# EAGLE design maple-r3 (EAGLE 5.01)
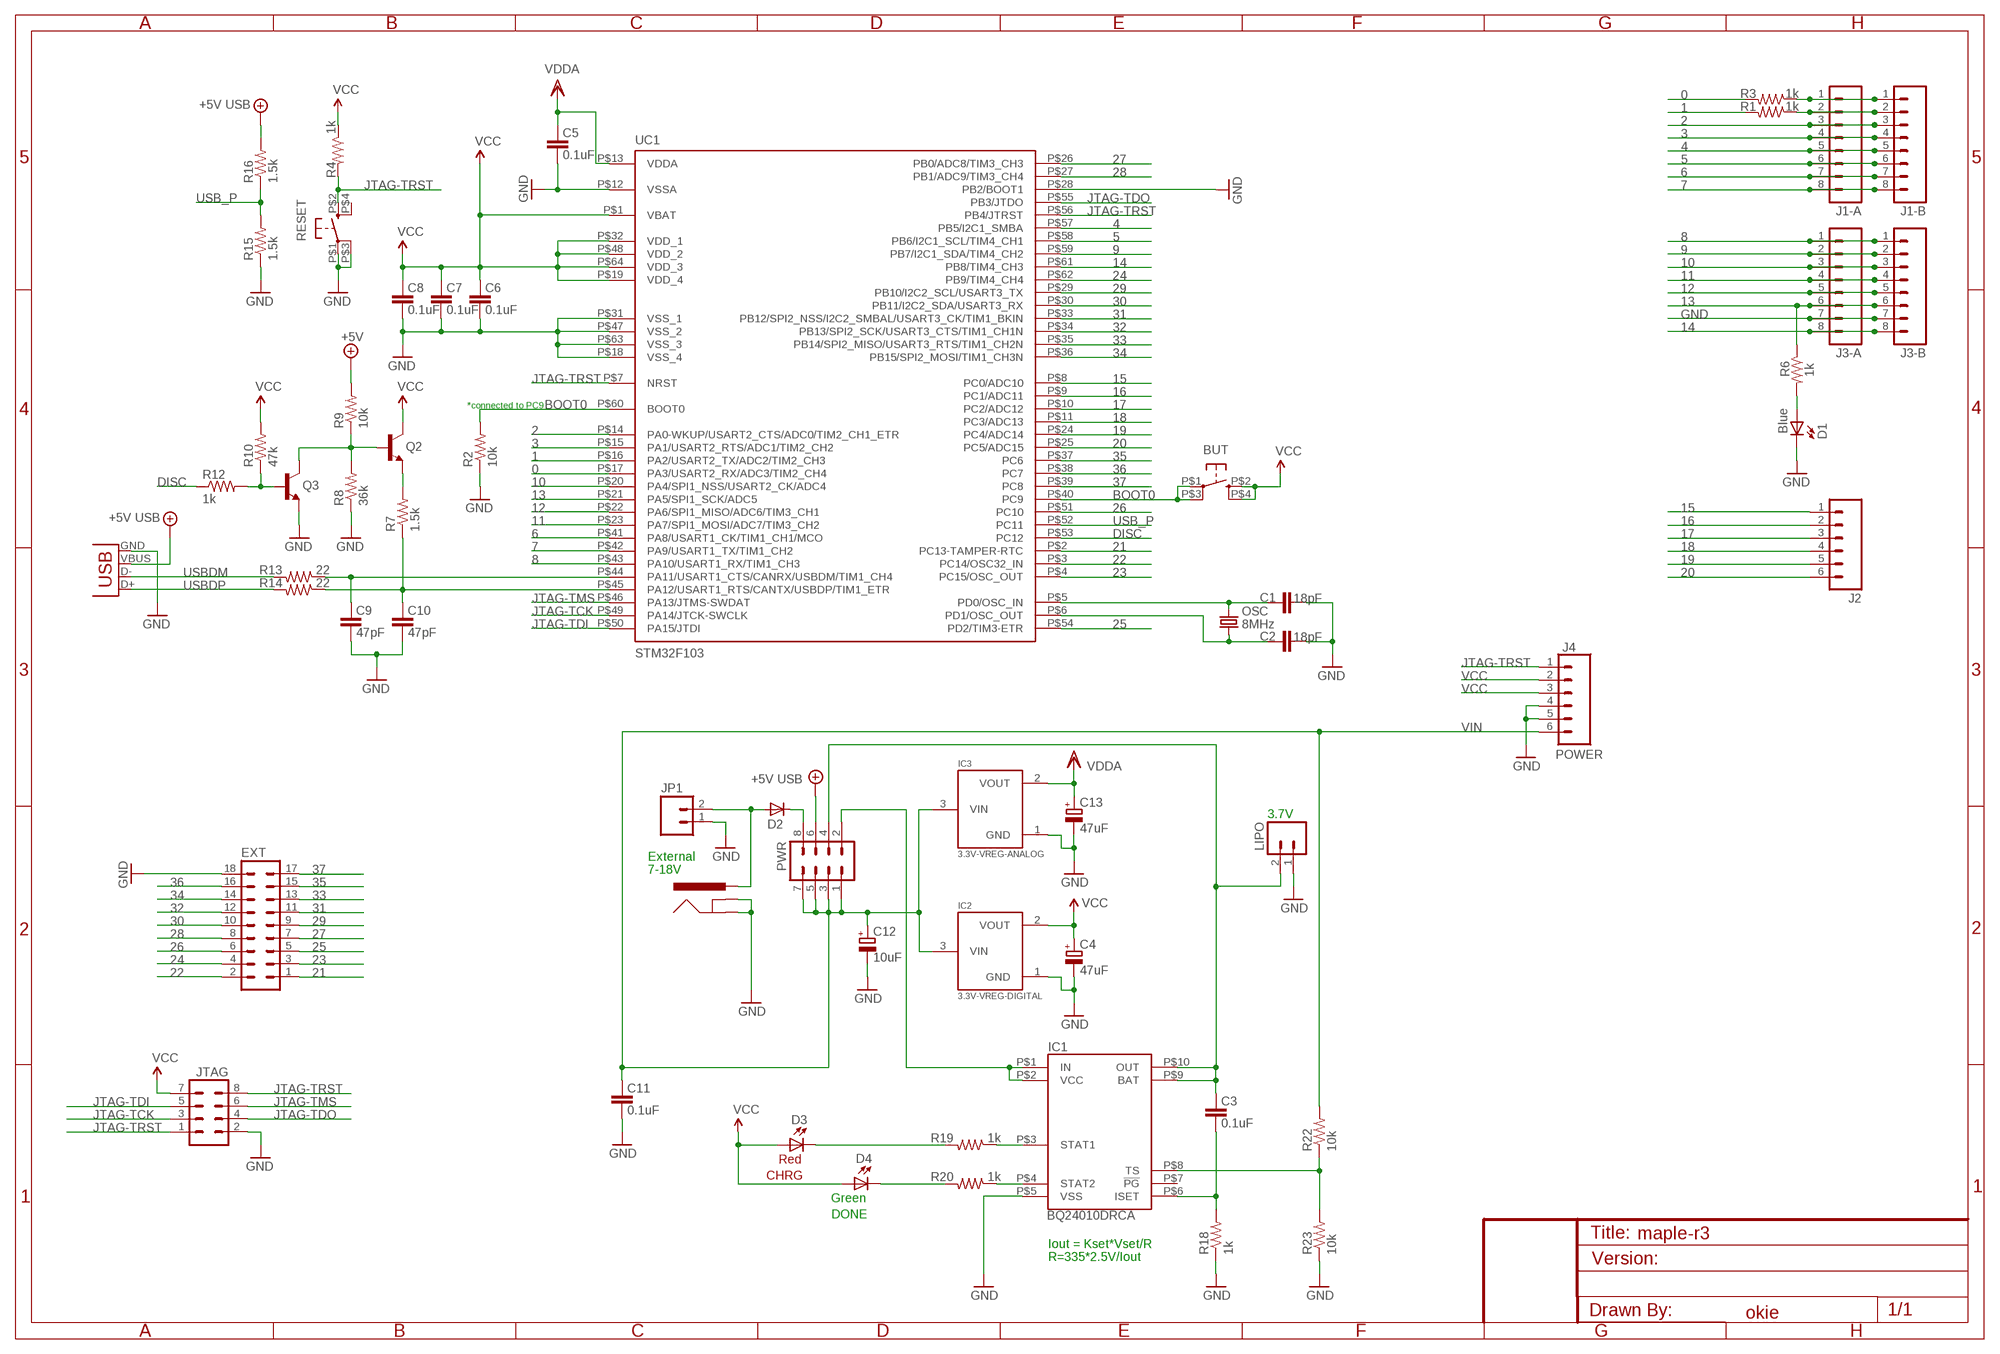
[diagram p0: schematic, sheet 1]

## Parts
BAR  POWER_JACKPTH  [POWER_JACK_PTH]
BUT  BUTTON-KMR241GLFS  [PUSHBUTTON-KMR241GLFS]
C1  18pF  CAP0402  [C0402]
C2  18pF  CAP0402  [C0402]
C3  0.1uF  CAP0402  [C0402]
C4  47uF  CPOL-EUUD-4X5,8  [UD-4X5,8_NICHICON]
C5  0.1uF  CAP0402  [C0402]
C6  0.1uF  CAP0402  [C0402]
C7  0.1uF  CAP0402  [C0402]
C8  0.1uF  CAP0402  [C0402]
C9  47pF  CAP0402  [C0402]
C10  47pF  CAP0402  [C0402]
C11  0.1uF  CAP0402  [C0402]
C12  10uF  CPOL-EUUD-4X5,8  [UD-4X5,8_NICHICON]
C13  47uF  CPOL-EUUD-4X5,8  [UD-4X5,8_NICHICON]
D1  Blue  LED0603  [LED-0603]
D2  DIODE-SOD323-W  [SOD323-W]
D3  Red  LED0603  [LED-0603]
D4  Green  LED0603  [LED-0603]
EXT  MA09-2  [MA09-2]
IC1  BQ24010DRCA  [PSON10-V2]
IC2  3.3V-VREG-DIGITAL  MCP1700T  [SOT23]
IC3  3.3V-VREG-ANALOG  MCP1700T  [SOT23]
J1-A  M08  [1X08]
J1-B  MA08-SQUARE  [1X08-SQUARE]
J2  M06SIP  [1X06]
J3-A  M08  [1X08]
J3-B  MA08-SQUARE  [1X08-SQUARE]
J4  POWER  M06SIP  [1X06]
JP1  M02PTH  [1X02]
JTAG  MA04-2  [MA04-2]
LIPO  LiPo  M02-JST-2MM-SMT  [S2B-PH]
OSC  8MHz  CRYSTAL5X3  [CRYSTAL-SMD-5X3]
PWR  MA04-2  [MA04-2]
Q2  TRANSISTOR_NPNSOT23  [SOT23]
Q3  TRANSISTOR_NPNSOT23  [SOT23]
R1  1k  RESISTOR0402  [C0402]
R2  10k  RESISTOR0402  [C0402]
R3  1k  RESISTOR0402  [C0402]
R4  1k  RESISTOR0402  [C0402]
R6  1k  RESISTOR0402  [C0402]
R7  1.5k  RESISTOR0402  [C0402]
R8  36k  RESISTOR0402  [C0402]
R9  10k  RESISTOR0402  [C0402]
R10  47k  RESISTOR0402  [C0402]
R12  1k  RESISTOR0402  [C0402]
R13  22  RESISTOR0402  [C0402]
R14  22  RESISTOR0402  [C0402]
R15  1.5k  RESISTOR0402  [C0402]
R16  1.5k  RESISTOR0402  [C0402]
R18  1k  RESISTOR0402  [C0402]
R19  1k  RESISTOR0402  [C0402]
R20  1k  RESISTOR0402  [C0402]
R22  10k  RESISTOR0402  [C0402]
R23  10k  RESISTOR0402  [C0402]
RESET  BUTTON-KMR241GLFS  [PUSHBUTTON-KMR241GLFS]
UC1  STM32F103  [TQFP-10X10-64]
X1  USBSMD  [USB-MINIB]

## Nets
0: R3.2 UC1.P$17(PA3/USART2_RX/ADC3/TIM2_CH4)
1: R1.2 UC1.P$16(PA2/USART2_TX/ADC2/TIM2_CH3)
2: J1-A.3 J1-B.3 UC1.P$14(PA0-WKUP/USART2_CTS/ADC0/TIM2_CH1_ETR)
3: J1-A.4 J1-B.4 UC1.P$15(PA1/USART2_RTS/ADC1/TIM2_CH2)
4: J1-A.5 J1-B.5 UC1.P$57(PB5/I2C1_SMBA)
5: J1-A.6 J1-B.6 UC1.P$58(PB6/I2C1_SCL/TIM4_CH1)
6: J1-A.7 J1-B.7 UC1.P$41(PA8/USART1_CK/TIM1_CH1/MCO)
7: J1-A.8 J1-B.8 UC1.P$42(PA9/USART1_TX/TIM1_CH2)
8: J3-A.1 J3-B.1 UC1.P$43(PA10/USART1_RX/TIM1_CH3)
9: J3-A.2 J3-B.2 UC1.P$59(PB7/I2C1_SDA/TIM4_CH2)
10: J3-A.3 J3-B.3 UC1.P$20(PA4/SPI1_NSS/USART2_CK/ADC4)
11: J3-A.4 J3-B.4 UC1.P$23(PA7/SPI1_MOSI/ADC7/TIM3_CH2)
12: J3-A.5 J3-B.5 UC1.P$22(PA6/SPI1_MISO/ADC6/TIM3_CH1)
13: J3-A.6 J3-B.6 R6.1 UC1.P$21(PA5/SPI1_SCK/ADC5)
14: J3-A.8 J3-B.8 UC1.P$61(PB8/TIM4_CH3)
15: J2.1 UC1.P$8(PC0/ADC10)
16: J2.2 UC1.P$9(PC1/ADC11)
17: J2.3 UC1.P$10(PC2/ADC12)
18: J2.4 UC1.P$11(PC3/ADC13)
19: J2.5 UC1.P$24(PC4/ADC14)
20: J2.6 UC1.P$25(PC5/ADC15)
21: EXT.1 UC1.P$2(PC13-TAMPER-RTC)
22: EXT.2 UC1.P$3(PC14/OSC32_IN)
23: EXT.3 UC1.P$4(PC15/OSC_OUT)
24: EXT.4 UC1.P$62(PB9/TIM4_CH4)
25: EXT.5 UC1.P$54(PD2/TIM3-ETR)
26: EXT.6 UC1.P$51(PC10)
27: EXT.7 UC1.P$26(PB0/ADC8/TIM3_CH3)
28: EXT.8 UC1.P$27(PB1/ADC9/TIM3_CH4)
29: EXT.9 UC1.P$29(PB10/I2C2_SCL/USART3_TX)
30: EXT.10 UC1.P$30(PB11/I2C2_SDA/USART3_RX)
31: EXT.11 UC1.P$33(PB12/SPI2_NSS/I2C2_SMBAL/USART3_CK/TIM1_BKIN)
32: EXT.12 UC1.P$34(PB13/SPI2_SCK/USART3_CTS/TIM1_CH1N)
33: EXT.13 UC1.P$35(PB14/SPI2_MISO/USART3_RTS/TIM1_CH2N)
34: EXT.14 UC1.P$36(PB15/SPI2_MOSI/TIM1_CH3N)
35: EXT.15 UC1.P$37(PC6)
36: EXT.16 UC1.P$38(PC7)
37: EXT.17 UC1.P$39(PC8)
+5V: PWR.6 R9.2 R16.2 X1.VBUS ; supply symbol labelled +5V USB
BOOT0: BUT.P$1 BUT.P$3 R2.2 UC1.P$40(PC9) UC1.P$60(BOOT0)
DISC: R12.1 UC1.P$53(PC12)
GND [vcc]: BAR.GND BAR.GNDBREAK C1.1 C2.1 C4.- C5.1 C6.1 C7.1 C8.1 C9.1 C10.1 C11.1 C12.- C13.- D1.C EXT.18 IC1.P$5(VSS) IC2.1(GND) IC3.1(GND) J3-A.7 J3-B.7 J4.4 J4.5 JP1.1 JTAG.2 LIPO.1 Q3.2(E) R2.1 R8.1 R15.1 R18.1 R23.1 RESET.P$1 RESET.P$3 UC1.P$12(VSSA) UC1.P$18(VSS_4) UC1.P$28(PB2/BOOT1) UC1.P$31(VSS_1) UC1.P$47(VSS_2) UC1.P$63(VSS_3) X1.GND
JTAG-TCK: JTAG.3 UC1.P$49(PA14/JTCK-SWCLK)
JTAG-TDI: JTAG.5 UC1.P$50(PA15/JTDI)
JTAG-TDO: JTAG.4 UC1.P$55(PB3/JTDO)
JTAG-TMS: JTAG.6 UC1.P$46(PA13/JTMS-SWDAT)
JTAG-TRST: J4.1 JTAG.1 JTAG.8 R4.2 RESET.P$2 UC1.P$7(NRST) UC1.P$56(PB4/JTRST)
N$1 [vcc]: BAR.PWR D2.A JP1.2
N$2: C2.2 OSC.1 UC1.P$6(PD1/OSC_OUT)
N$3: IC1.P$8(TS) R22.1 R23.2
N$5: D2.C PWR.8
N$6: C1.2 OSC.3 UC1.P$5(PD0/OSC_IN)
N$7: D1.A R6.2
N$8: Q2.2(E) R7.2
N$9: Q2.1(B) Q3.3(C) R8.2 R9.1
N$10: Q3.1(B) R10.1 R12.2
N$11: C9.2 R13.1 UC1.P$44(PA11/USART1_CTS/CANRX/USBDM/TIM1_CH4)
N$12: C10.2 R7.1 R14.1 UC1.P$45(PA12/USART1_RTS/CANTX/USBDP/TIM1_ETR)
N$13: IC1.P$1(IN) IC1.P$2(VCC) PWR.2
N$16 [vcc]: C3.2 IC1.P$9(BAT) IC1.P$10(OUT) LIPO.2 PWR.4
N$19: C3.1 IC1.P$6(ISET) R18.2
N$20: D4.C R20.2
N$21: D3.C R19.2
N$22: IC1.P$3(STAT1) R19.1
N$23: IC1.P$4(STAT2) R20.1
RX-IP: J1-A.2 J1-B.2 R1.1
TX-OP: J1-A.1 J1-B.1 R3.1
USB_P: R15.2 R16.1 UC1.P$52(PC11)
USBDM: R13.2 X1.D-
USBDP: R14.2 X1.D+
VCC: BUT.P$2 BUT.P$4 C4.+ C6.2 C7.2 C8.2 D3.A D4.A IC2.2(VOUT) J4.2 J4.3 JTAG.7 Q2.3(C) R4.1 R10.2 UC1.P$1(VBAT) UC1.P$19(VDD_4) UC1.P$32(VDD_1) UC1.P$48(VDD_2) UC1.P$64(VDD_3)
VDD: C5.2 C13.+ IC3.2(VOUT) UC1.P$13(VDDA) ; supply symbol labelled VDDA
VIN: C11.2 C12.+ IC2.3(VIN) IC3.3(VIN) J4.6 PWR.1 PWR.3 PWR.5 PWR.7 R22.2
Unconnected: IC1.P$7(!PG) RESET.P$4

## Notes on the sheet
- *connected to PC9
- 3.7V
- External
- 7-18V
- CHRG
- DONE
- Iout = Kset*Vset/R
- R=335*2.5V/Iout
- okie

## Library data of the parts
BAR = SparkFun2:POWER_JACK: Power Jack This is the standard 5.5mm barrel jack for power. The PTH is the most common, proven, reliable, footprint. All others are experimental. The Slot footprint only works if the mill layer is transmitted to the PCB fab house so be warned. Spark Fun Electronics SKU : PRT-00119. Mating wall wart : TOL-00298 (and others)
BUT RESET = okie:BUTTON-KMR241GLFS
C1-C3 C5-C11 = SparkFun:CAP: Capacitor Standard 0603 ceramic capacitor, and 0.1" leaded capacitor.
C4 C12 C13 = rcl:CPOL-EU: POLARIZED CAPACITOR, European symbol
D1 D3 D4 = SparkFun:LED: LEDs Standard schematic elements and footprints for 5mm, 3mm, 1206, and 0603 sized LEDs. 5mm - Spark Fun Electronics SKU : COM-00529 (and others)
D2 = diode:DIODE-: DIODE
EXT = con-lstb:MA09-2: PIN HEADER
IC1 = okie:BQ24010DRC
IC2 IC3 = okie:MCP1700T
J1-A J3-A = SparkFun:M08: Header 8 Standard 8-pin 0.1" header. Use with straight break away headers (SKU : PRT-00116), right angle break away headers (PRT-00553), swiss pins (PRT-00743), machine pins (PRT-00117), and female headers (PRT-00115).
J1-B J3-B = SparkFun2:MA08-SQUARE
J2 J4 = SparkFun:M06: Header 6 Standard 6-pin 0.1" header. Use with straight break away headers (SKU : PRT-00116), right angle break away headers (PRT-00553), swiss pins (PRT-00743), machine pins (PRT-00117), and female headers (PRT-00115). Molex polarized connector foot print use with SKU : PRT-08094 with associated crimp pins and housings.
JP1 = SparkFun2:M02: Header 2 Standard 2-pin 0.1" header. Use with straight break away headers (SKU : PRT-00116), right angle break away headers (PRT-00553), swiss pins (PRT-00743), machine pins (PRT-00117), and female headers (PRT-00115). Molex polarized connector foot print use with SKU : PRT-08233 with associated crimp pins and housings.
JTAG PWR = con-lstb:MA04-2: PIN HEADER
LIPO = SparkFun:M02: Header 2 Standard 2-pin 0.1" header. Use with straight break away headers (SKU : PRT-00116), right angle break away headers (PRT-00553), swiss pins (PRT-00743), machine pins (PRT-00117), and female headers (PRT-00115). Molex polarized connector foot print use with SKU : PRT-08233 with associated crimp pins and housings.
OSC = SparkFun2:CRYSTAL: Crystals Various standard crystals. Proven footprints. Spark Fun Electronics SKU : COM-00534
Q2 Q3 = SparkFun2:TRANSISTOR_NPN: Transistor NPN BJT configuration in SOT23 package. MMBT2222 is the common NPN we use. Double check BCE configuration again layout.
R1-R4 R6-R10 R12-R16 R18-R20 R22 R23 = SparkFun:RESISTOR: Resistor Basic schematic elements and footprints for 0603, 1206, and PTH 1/10th watt (small) resistors.
UC1 = st-microelectronics:STM32F103
X1 = SparkFun2:USB: USB Connectors USB-B-PTH is fully proven SKU : PRT-00139 USB-miniB is fully proven SKU : PRT-00587 USB-A-PCB is untested. USB-A-H is throughly reviewed, but untested. Spark Fun Electronics SKU : PRT-00437 USB-B-SMT is throughly reviewed, but untested. Needs silkscreen touching up. USB-A-S has not been used/tested USB-MB-H has not been used/tested

## Net classes
0 default: width 0.203 mm
1 vcc: width 0.254 mm
2 gnd: width 0.305 mm, drill 0.508 mm, clearance 0.152 mm
3 usbvcc: width 0.508 mm, drill 0.508 mm, clearance 0.152 mm

## Board
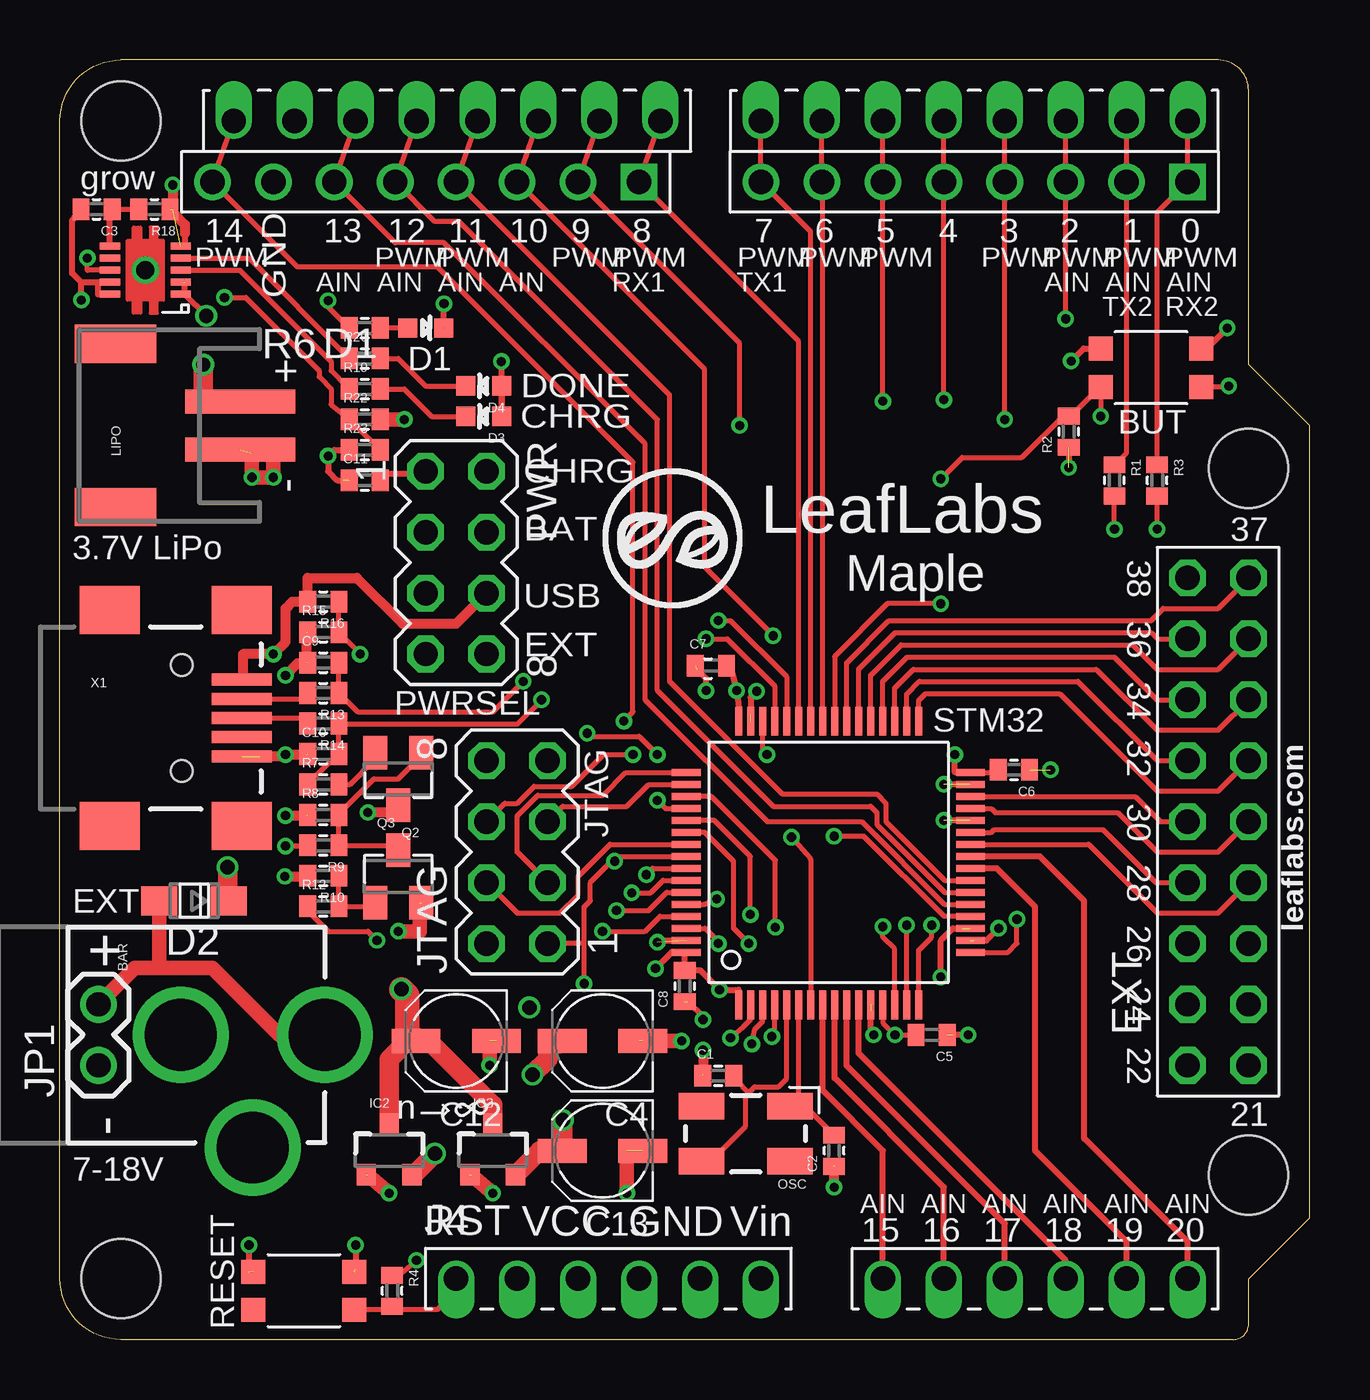
[diagram p1: board, top side]
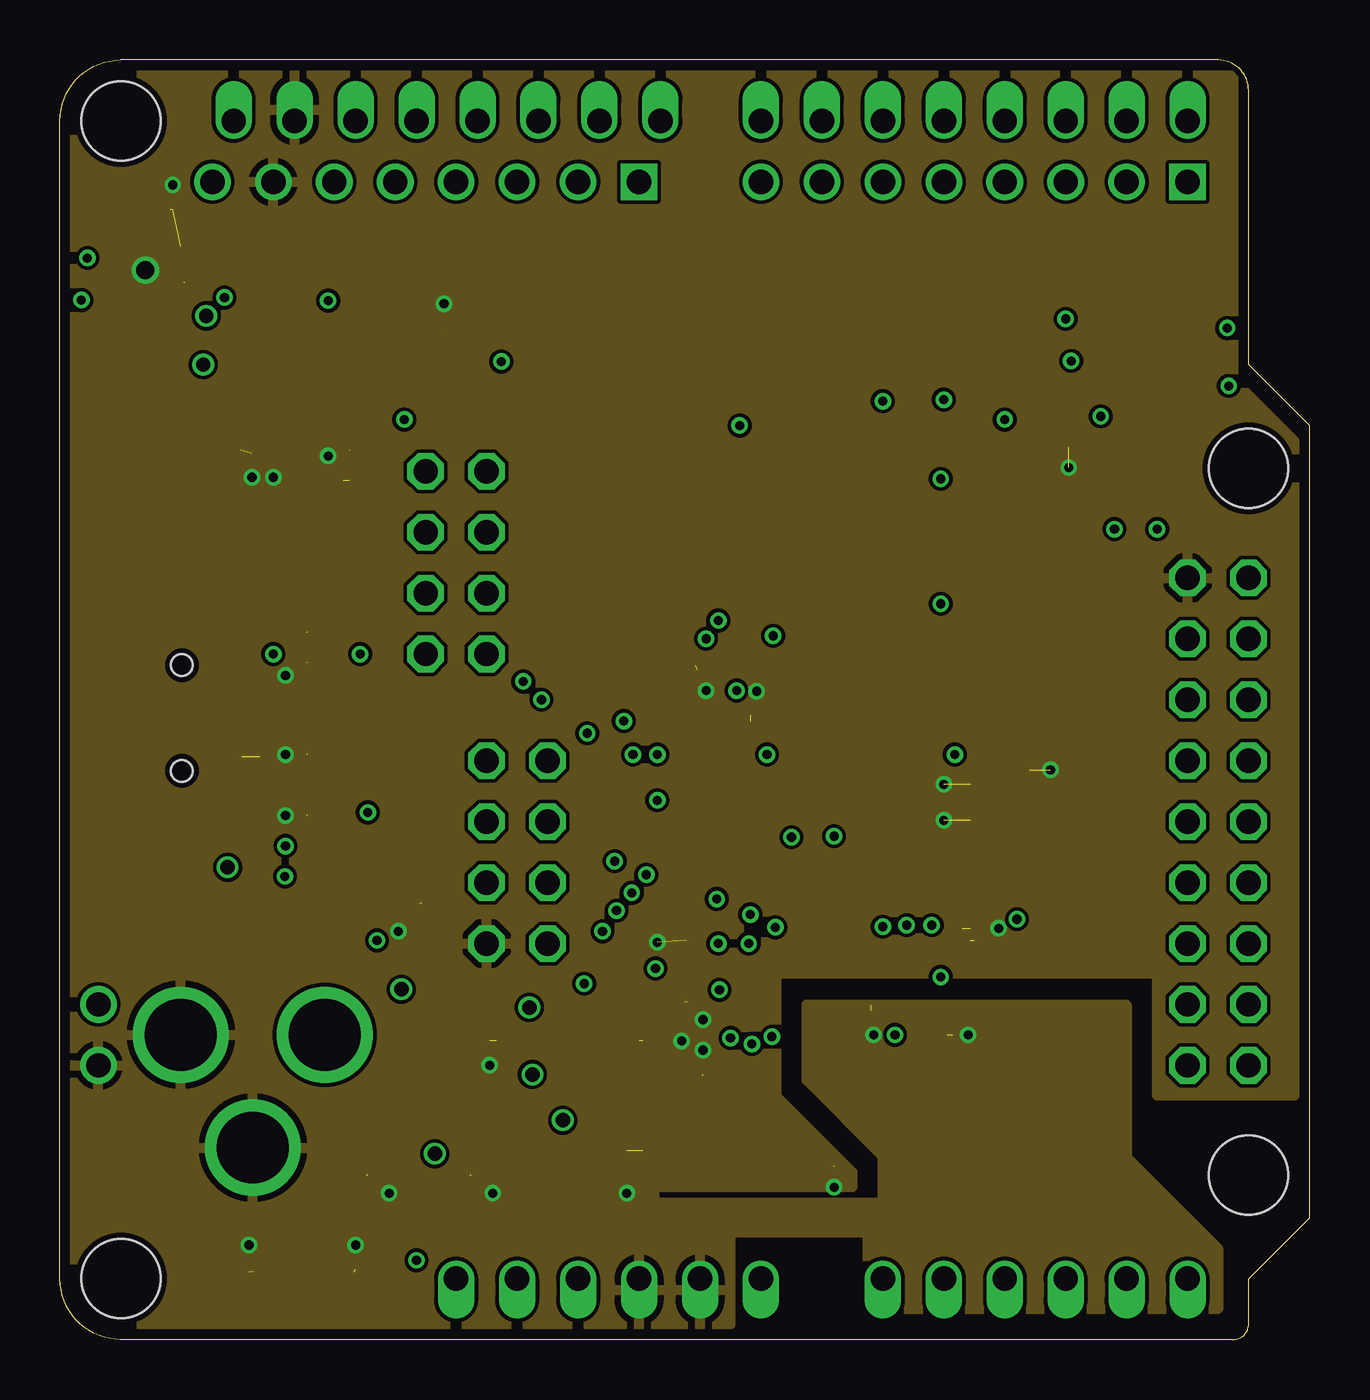
[diagram p2: board, inner layer gndplane]
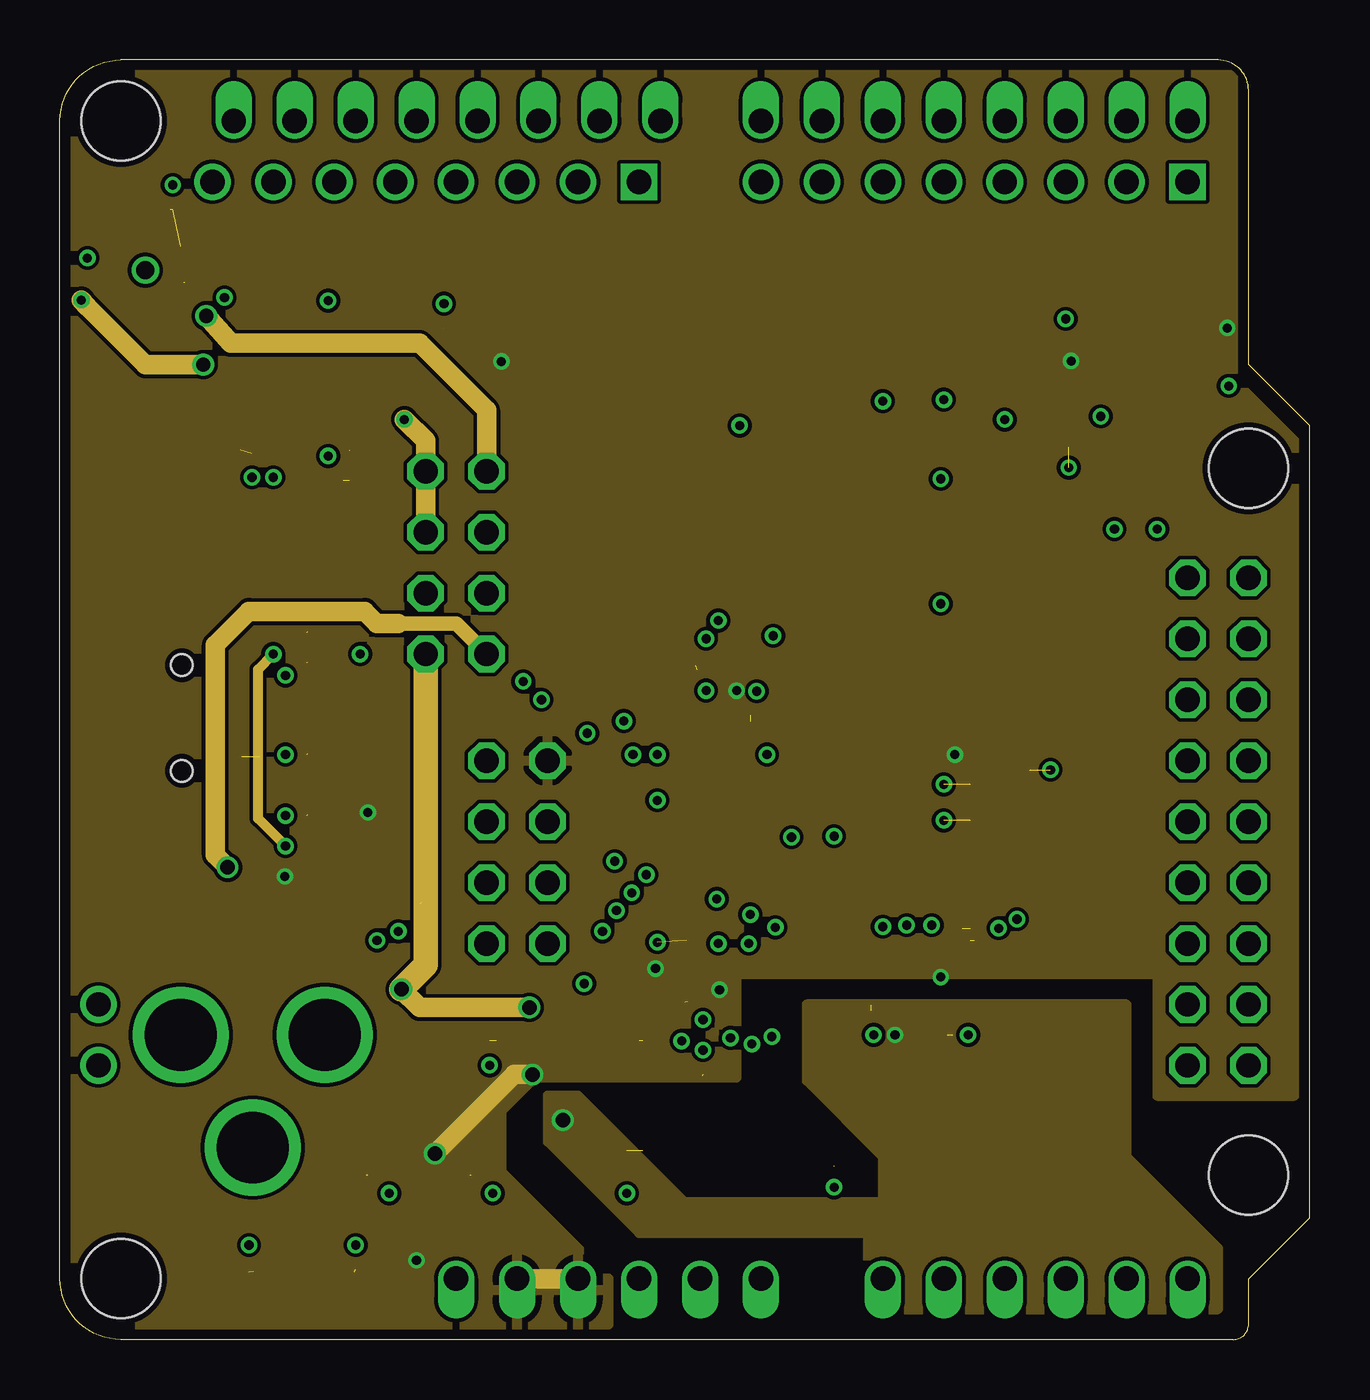
[diagram p3: board, inner layer Route15]
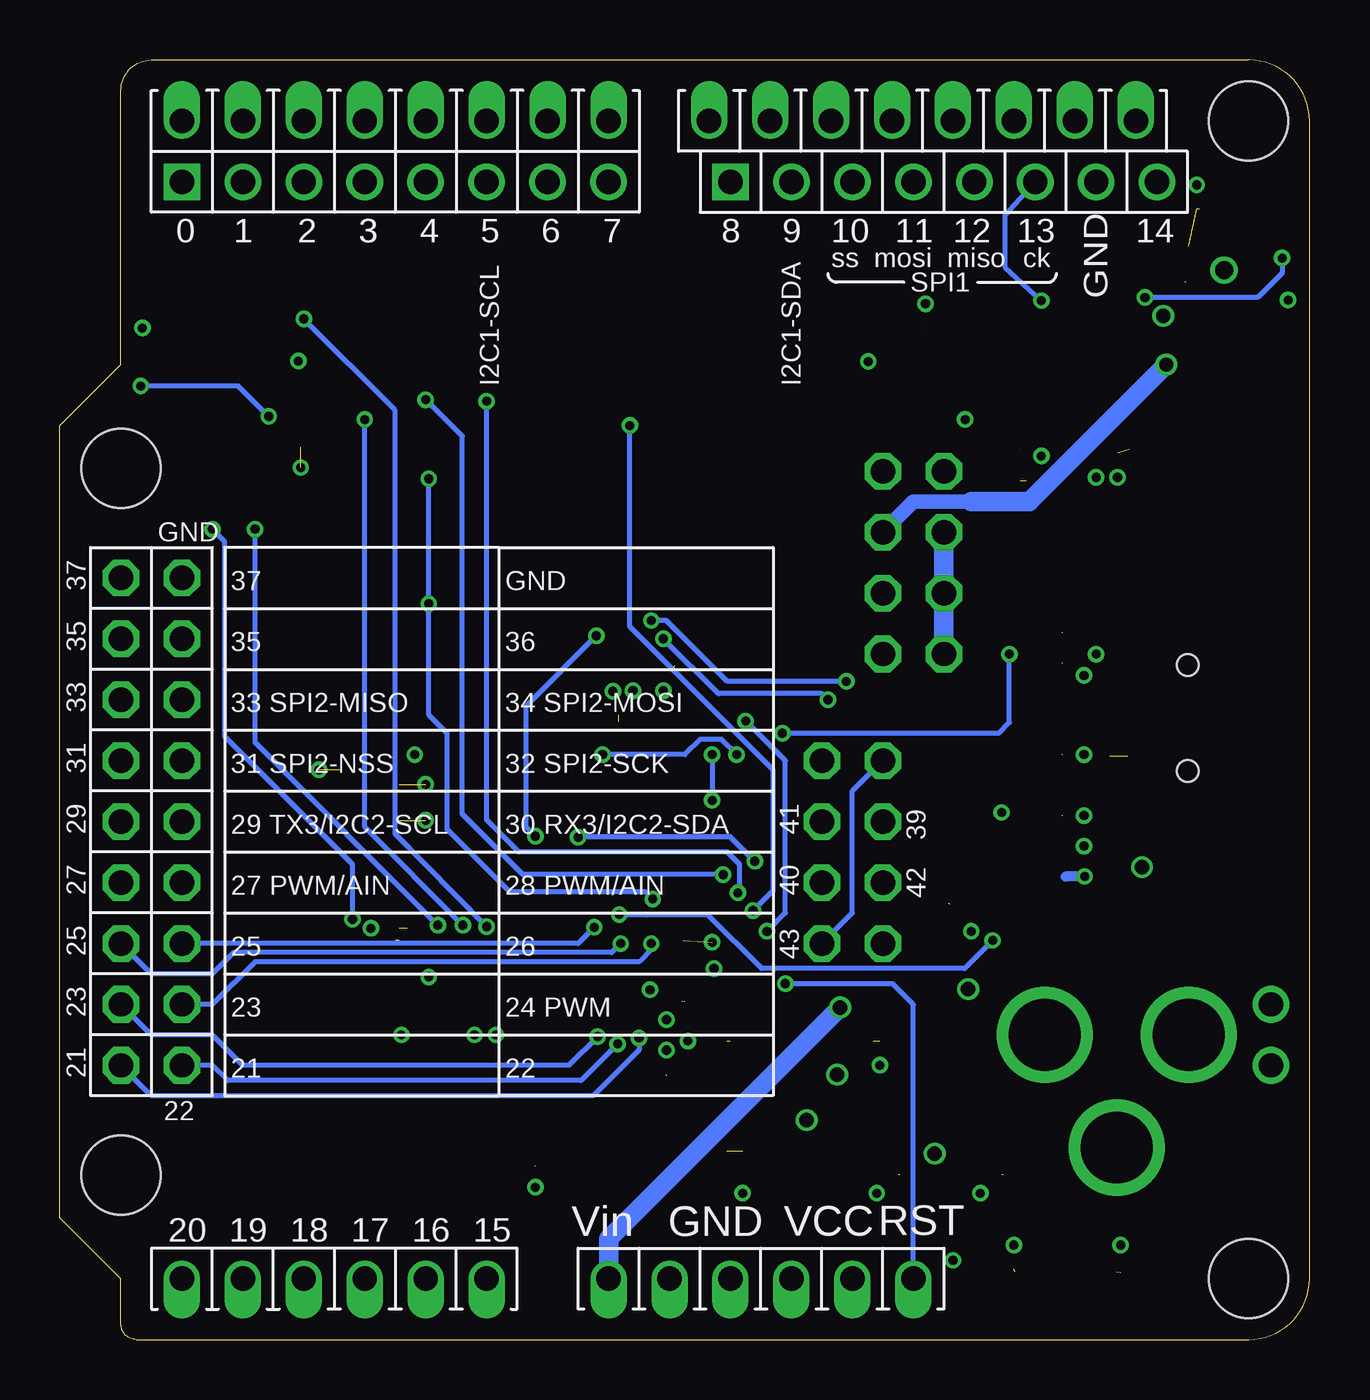
[diagram p4: board, bottom side, seen from below]

Size 52.07 x 53.34 mm. Coordinates in mm from the lower left corner, seen from the top.
Outline: 49.53,2.54 52.07,5.08 52.07,38.1 49.53,40.64 49.53,52.07 arc90 48.26,53.34 2.54,53.34 arc90 0,50.8 0,2.54 arc90 2.54,0 48.9,0 arc90 49.53,0.64 49.53,2.54
Copper layers (1*16): Top 0.035mm / dielectric 1.5mm / Bottom 0.035mm
Design rules "SparkFun *": minimum track width 6mil, minimum drill 15mil, track to track 6mil, track to pad 6mil, pad to pad 6mil, via to via 6mil, smd to smd 6mil, copper to edge 10mil, drill to drill 15mil, minimum pad ring 8mil, minimum via ring 6mil, stop-mask expansion 0mil, vias tented up to drill 20mil, thermal gap 10mil

### Footprints (pad centres in the part's own frame; a part is rotated, then mirrored left to right if it is on the bottom)
POWER_JACK_PTH = drill 2.997 round: GND 0,7.7; GNDBREAK 4.7,10.7; PWR 0,13.7
PUSHBUTTON-KMR241GLFS = smd 1 x 1: P$1 2.1,0.8; P$2 2.1,-0.8; P$3 -2.1,0.8; P$4 -2.1,-0.8
C0402 = smd 0.7 x 0.9: 1 -0.65,0; 2 0.65,0
UD-4X5,8_NICHICON = smd 2.032 x 1: + 1.679,0; - -1.679,0
LED-0603 = smd 0.8 x 0.8: A 0,-0.75; C 0,0.75
SOD323-W = smd 1.5 x 1.2: A 1.45,0; C -1.45,0
MA09-2 = drill 1.016 octagon: 1 -10.16,-1.27; 2 -10.16,1.27; 3 -7.62,-1.27; 4 -7.62,1.27; 5 -5.08,-1.27; 6 -5.08,1.27; 7 -2.54,-1.27; 8 -2.54,1.27; 9 0,-1.27; 10 0,1.27; 11 2.54,-1.27; 12 2.54,1.27; 13 5.08,-1.27; 14 5.08,1.27; 15 7.62,-1.27; 16 7.62,1.27; 17 10.16,-1.27; 18 10.16,1.27
PSON10-V2 = smd 0.85 x 0.28: P$1 -1.475,1; P$2 -1.475,0.5; P$3 -1.475,0; P$4 -1.475,-0.5; P$5 -1.475,-1; P$6 1.475,-1; P$7 1.475,-0.5; P$8 1.475,0; P$9 1.475,0.5; P$10 1.475,1
SOT23 = smd 0.8 x 0.9: 1 -0.95,-1; 2 0.95,-1; 3 0,1.1
1X08 = drill 1.016 offset: 1 0,0; 2 2.54,0; 3 5.08,0; 4 7.62,0; 5 10.16,0; 6 12.7,0; 7 15.24,0; 8 17.78,0
1X08-SQUARE = drill 1.016 square: 1 -8.89,0 | drill 1.016 round: 2 -6.35,0; 3 -3.81,0; 4 -1.27,0; 5 1.27,0; 6 3.81,0; 7 6.35,0; 8 8.89,0
1X06 = drill 1.016 offset: 1 0,0; 2 2.54,0; 3 5.08,0; 4 7.62,0; 5 10.16,0; 6 12.7,0
1X02 = drill 1.016 round: 1 0,0; 2 2.54,0
MA04-2 = drill 1.016 octagon: 1 -3.81,-1.27; 2 -3.81,1.27; 3 -1.27,-1.27; 4 -1.27,1.27; 5 1.27,-1.27; 6 1.27,1.27; 7 3.81,-1.27; 8 3.81,1.27
S2B-PH = smd 1 x 4.6: 1 -1,-3.7; 2 1,-3.7 | smd 1.6 x 3.4: NC1 -3.4,1.5; NC2 3.4,1.5
CRYSTAL-SMD-5X3 = smd 1.9 x 1.1: 1 -1.85,-1.15; 2 1.85,-1.15; 3 1.85,1.15; 4 -1.85,1.15
SOT23' = smd 1 x 1.4: 1 -0.95,-1.1; 2 0.95,-1.1; 3 0,1.1
STAND-OFF = hole 3.302: 0,0
TQFP-10X10-64 = smd 1.2 x 0.3: P$1 -5.936,3.75; P$2 -5.936,3.25; P$3 -5.936,2.75; P$4 -5.936,2.25; P$5 -5.936,1.75; P$6 -5.936,1.25; P$7 -5.936,0.75; P$8 -5.936,0.25; P$9 -5.936,-0.25; P$10 -5.936,-0.75; P$11 -5.936,-1.25; P$12 -5.936,-1.75; P$13 -5.936,-2.25; P$14 -5.936,-2.75; P$15 -5.936,-3.25; P$16 -5.936,-3.75; P$33 5.886,-3.75; P$34 5.886,-3.25; P$35 5.886,-2.75; P$36 5.886,-2.25; P$37 5.886,-1.75; P$38 5.886,-1.25; P$39 5.886,-0.75; P$40 5.886,-0.25; P$41 5.886,0.25; P$42 5.886,0.75; P$43 5.886,1.25; P$44 5.886,1.75; P$45 5.886,2.25; P$46 5.886,2.75; P$47 5.886,3.25; P$48 5.886,3.75 | smd 0.3 x 1.2: P$17 -3.75,-5.911; P$18 -3.25,-5.911; P$19 -2.75,-5.911; P$20 -2.25,-5.911; P$21 -1.75,-5.911; P$22 -1.25,-5.911; P$23 -0.75,-5.911; P$24 -0.25,-5.911; P$25 0.25,-5.911; P$26 0.75,-5.911; P$27 1.25,-5.911; P$28 1.75,-5.911; P$29 2.25,-5.911; P$30 2.75,-5.911; P$31 3.25,-5.911; P$32 3.75,-5.911; P$49 3.75,5.936; P$50 3.25,5.936; P$51 2.75,5.936; P$52 2.25,5.936; P$53 1.75,5.936; P$54 1.25,5.936; P$55 0.75,5.936; P$56 0.25,5.936; P$57 -0.25,5.936; P$58 -0.75,5.936; P$59 -1.25,5.936; P$60 -1.75,5.936; P$61 -2.25,5.936; P$62 -2.75,5.936; P$63 -3.25,5.936; P$64 -3.75,5.936
USB-MINIB = smd 2.5 x 0.5: D+ 2.5,0; D- 2.5,0.8; GND 2.5,-1.6; ID 2.5,-0.8; VBUS 2.5,1.6 | smd 2.5 x 2: GND@1 -3,-4.5; GND@2 -3,4.5; GND@3 2.5,4.5; GND@4 2.5,-4.5 | hole 0.9: 0,2.2; 0,-2.2

### Placement (x,y rotation side)
BAR  -2.67,12.7 270 top
BUT  45.47,40.51 180 top
C1  27.43,11 0 top
C2  32.26,7.87 90 top
C3  1.52,47.12 180 top
C4  22.61,12.45 180 top
C5  36.32,12.7 180 top
C6  39.75,23.75 180 top
C7  27.13,28.09 0 top
C8  26.04,14.73 90 top
C9  10.97,28.22 0 top
C10  10.97,24.41 0 top
C11  12.7,35.81 0 top
C12  16.51,12.45 180 top
C13  22.61,7.87 180 top
D1  15.24,42.16 270 top
D2  5.59,18.29 180 top
D3  17.65,38.48 90 top
D4  17.65,39.75 90 top
EXT  48.26,21.59 90 top
IC1  3.56,44.58 180 top
IC2  13.72,7.87 0 top
IC3  18.03,7.87 0 top
J1-A  46.99,50.8 180 top
J1-B  38.1,48.26 180 top
J2  34.29,2.54 0 top
J3-A  25.02,50.8 180 top
J3-B  15.24,48.26 180 top
J4  16.51,2.54 0 top
JP1  1.6,11.43 90 top
JTAG  19.05,20.32 90 top
LIPO  3.81,38.1 90 top
OSC  28.57,8.59 180 top
PWR  16.51,32.38 270 top
Q2  [SOT23']  14.1,23.37 180 top
Q3  [SOT23']  14.1,19.3 0 top
R1  43.94,35.81 270 top
R2  42.04,37.85 90 top
R3  45.72,35.81 270 top
R4  13.84,2.03 270 top
R6  12.7,42.16 0 top
R7  10.97,23.14 0 top
R8  10.97,21.87 0 top
R9  10.97,20.6 180 top
R10  10.97,19.33 180 top
R12  10.97,18.06 0 top
R13  10.97,26.95 180 top
R14  10.97,25.68 180 top
R15  10.97,29.49 0 top
R16  10.97,30.76 180 top
R18  3.94,47.12 180 top
R19  12.7,39.62 0 top
R20  12.7,40.89 0 top
R22  12.7,38.35 0 top
R23  12.7,37.08 0 top
RESET  10.16,2.03 0 top
U$1  STAND-OFF  [STAND-OFF]  2.54,2.54 0 top
U$2  STAND-OFF  [STAND-OFF]  49.53,36.32 0 top
U$4  STAND-OFF  [STAND-OFF]  2.54,50.8 0 top
U$10  STAND-OFF  [STAND-OFF]  49.53,6.86 0 top
UC1  32.03,19.89 90 top
X1  5.08,25.91 0 top

### Tracks (layer width: path | path; a pad name or v marks a point on that pad's centre or on a via)
0  (via drill 0.38)
  Top 0.203: v39.88,17.53 39.88,16.51 39.51,16.14 UC1.P$17 | v45.72,33.78 R3.2
  Bottom 0.203: v39.88,17.53 39.88,19.81 45.21,25.15 45.21,33.27 v45.72,33.78
1  (via drill 0.38)
  Top 0.203: UC1.P$16 35.78,16.22 36.32,16.76 v36.32,17.27 | v43.94,33.78 R1.2
  Bottom 0.203: v36.32,17.27 43.94,24.89 v43.94,33.78
2  (via drill 0.38)
  Top 0.203: J1-B.3 J1-A.3 J1-B.3 | UC1.P$14 34.78,16.27 34.29,16.76 v34.29,17.21 | v41.91,42.55 J1-B.3
  Bottom 0.203: v34.29,17.21 38.1,21.08 38.1,38.73 v41.91,42.55
3  (via drill 0.38)
  Top 0.203: J1-B.4 J1-A.4 J1-B.4 | UC1.P$15 v35.28,17.27 | v39.37,38.35 J1-B.4
  Bottom 0.203: v35.28,17.27 39.37,21.36 v39.37,38.35
4  (via drill 0.38)
  Top 0.203: J1-B.5 J1-A.5 J1-B.5 | UC1.P$57 24.69,19.64 v24.43,19.38 | v36.83,39.18 J1-B.5
  Bottom 0.203: v36.83,39.18 35.31,37.66 35.31,21.91 32.78,19.38 v24.43,19.38
5  (via drill 0.38)
  Top 0.203: J1-B.6 J1-A.6 J1-B.6 | UC1.P$58 25.13,19.14 24.61,18.62 v23.82,18.62 | v34.29,39.12 J1-B.6
  Bottom 0.203: v23.82,18.62 23.82,18.64 23.75,18.72 23.75,19.81 24.26,20.32 32.96,20.32 34.29,21.65 v34.29,39.12
6
  Top 0.203: J1-B.7 J1-A.7 | UC1.P$41 31.78,48.23
  Top 0.254: 31.77,48.23 31.77,48.21 | 31.78,48.23 31.77,48.23 | J1-B.7 31.77,48.23
7
  Top 0.203: J1-A.8 J1-B.8 31.28,46.19 UC1.P$42
8
  Top 0.203: UC1.P$43 30.78,41.61 J3-B.1 J3-A.1
9  (via drill 0.38)
  Top 0.203: UC1.P$59 25.29,18.64 24.54,17.88 v23.19,17.88 | v28.32,38.1 28.32,41.53 J3-B.2 J3-A.2
  Bottom 0.203: v23.19,17.88 22.35,18.72 22.35,23.75 28.32,29.72 v28.32,38.1
10  (via drill 0.38)
  Top 0.203: UC1.P$20 36.84,17.64 33.5,20.98 v32.26,20.98 | v29.72,29.34 26.86,32.19 26.86,40.45 J3-B.3 J3-A.3
  Bottom 0.203: v29.72,29.34 32.64,26.42 32.64,21.36 v32.26,20.98
11
  Top 0.203: UC1.P$23 36.87,19.14 34.42,21.59 34.42,22.35 34.04,22.73 30.1,22.73 25.4,27.43 25.4,39.37 J3-B.4 J3-A.4
12
  Top 0.203: UC1.P$22 36.86,18.64 34.04,21.46 34.04,21.97 33.78,22.23 29.72,22.23 24.89,27.05 24.89,38.35 16.64,46.61 15.62,46.61 J3-B.5 J3-A.5
13  (via drill 0.38)
  Top 0.203: UC1.P$21 36.85,18.14 33.4,21.59 29.46,21.59 24.38,26.67 24.38,37.34 16,45.72 13.97,45.72 J3-B.6 J3-A.6 | R6.1 11.18,43.04 v11.18,43.31
  Bottom 0.203: J3-B.6 12.7,46.86 12.7,44.7 v11.18,43.31
14  (via drill 0.38)
  Top 0.203: UC1.P$61 25,17.64 24.38,17.02 v22.61,17.02 | v23.5,25.78 23.88,26.16 23.88,36.58 15.75,44.7 9.91,44.7 J3-B.8 J3-A.8
  Bottom 0.203: v22.61,17.02 21.84,17.78 21.84,24.13 v23.5,25.78
15
  Top 0.254: UC1.P$8 31.78,10.38 34.29,7.87 J2.1
16
  Top 0.254: UC1.P$9 32.28,10.9 36.83,6.35 J2.2
17
  Top 0.254: UC1.P$10 32.78,11.42 39.37,4.83 J2.3
18
  Top 0.254: UC1.P$11 33.28,11.93 41.91,3.3 J2.4
19
  Top 0.254: UC1.P$24 39.04,19.64 40.64,18.03 40.64,7.87 44.45,4.06 J2.5
20
  Top 0.254: UC1.P$25 40.82,20.14 42.67,18.29 42.67,8.38 46.99,4.06 J2.6
21  (via drill 0.38)
  Top 0.203: UC1.P$2 28.78,13.34 28.47,13.03 v27.94,12.57
  Bottom 0.203: EXT.1 48.26,10.16 29.84,10.16 27.94,12.06 v27.94,12.57
22  (via drill 0.38)
  Top 0.203: UC1.P$3 29.28,13.25 28.96,12.93 28.83,12.27 v28.83,12.32
  Bottom 0.203: EXT.2 45.72,11.43 45.09,10.79 30.35,10.79 v28.83,12.32
23  (via drill 0.38)
  Top 0.203: v29.67,12.62 29.72,12.57 29.78,12.63 UC1.P$4
  Bottom 0.203: EXT.3 48.26,12.7 45.72,12.7 44.45,11.43 30.86,11.43 v29.67,12.62 29.59,12.7 29.87,12.7
24  (via drill 0.38)
  Top 0.203: UC1.P$62 26.88,17.14 27.43,16.59 v27.43,16.51
  Bottom 0.203: v27.43,16.51 27.43,16.26 27.94,15.75 43.94,15.75 45.72,13.97 EXT.4
25  (via drill 0.38)
  Top 0.203: UC1.P$54 26.87,21.14 28.07,19.94 28.07,17.14 v28.7,16.51
  Bottom 0.203: v28.7,16.51 29.08,16.13 44.83,16.13 45.72,15.24 48.26,15.24 EXT.5
26  (via drill 0.38)
  Top 0.203: UC1.P$51 27.15,22.64 29.81,19.98 v29.81,17.18
  Bottom 0.203: v29.81,17.18 30.48,16.51 EXT.6
27
  Top 0.203: UC1.P$26 42.86,20.64 45.72,17.78 48.26,17.78 EXT.7
28
  Top 0.203: UC1.P$27 38.82,21.14 38.94,21.26 43.46,21.26 45.67,19.05 EXT.8
29
  Top 0.203: UC1.P$29 38.8,22.14 38.96,21.97 44.07,21.97 45.72,20.32 48.26,20.32 EXT.9
30
  Top 0.203: UC1.P$30 44.8,22.64 45.85,21.59 EXT.10
31
  Top 0.203: UC1.P$33 35.78,26.64 36.07,26.92 41.66,26.92 45.72,22.86 48.26,22.86 EXT.11
32
  Top 0.203: UC1.P$34 35.28,26.9 35.81,27.43 42.42,27.43 45.72,24.13 EXT.12
33
  Top 0.203: UC1.P$35 34.78,27.16 35.56,27.94 43.18,27.94 45.72,25.4 48.26,25.4 EXT.13
34
  Top 0.203: UC1.P$36 34.28,27.42 35.31,28.45 43.94,28.45 45.72,26.67 EXT.14
35
  Top 0.203: UC1.P$37 33.78,27.68 35.05,28.96 44.7,28.96 45.72,27.94 48.26,27.94 EXT.15
36
  Top 0.203: UC1.P$38 33.28,27.95 34.8,29.46 45.47,29.46 45.72,29.21 EXT.16
37
  Top 0.203: UC1.P$39 32.78,28.21 34.54,29.97 45.47,29.97 45.97,30.48 48.26,30.48 EXT.17
+5V  (via drill 0.38)
  Top 0.203: 9.88,20.57 9.78,20.57 | 9.88,20.57 10.3,20.57 | v9.4,20.57 9.88,20.57
  Top 0.406: 7.62,27.51 X1.VBUS | 7.62,27.51 8.59,27.51 | 10.3,20.57 R9.2 | 7.62,27.51 7.62,28.57 v8.89,28.57 9.4,29.08 9.4,30.48 9.68,30.76 R16.2 10.32,31.75 12.37,31.75 14.28,29.84 16.51,29.84 PWR.6
  Route15 0.406: v9.4,20.57 8.26,21.72 8.26,27.94 v8.89,28.57
BOOT0  (via drill 0.38 pad 0.38)
  Top 0.203: UC1.P$60 26.84,18.14 v27.37,18.36 | UC1.P$40 32.28,28.47 34.48,30.67 v36.7,30.67 | v36.7,35.88 37.59,36.77 40.07,36.77 41.85,38.54 42.02,38.54 R2.2 42.24,38.62 43.24,39.62 43.28,39.46 BUT.P$1 | 43.37,39.43 43.37,39.44 BUT.P$1 | BUT.P$3 48.73,39.71 v48.7,39.75 | BUT.P$1 43.37,39.63 43.37,39.62 v43.37,38.48
  Bottom 0.203: v36.7,35.88 v36.7,30.67 36.7,26.04 35.94,25.27 35.94,21.27 33.34,18.67 27.67,18.67 v27.37,18.36 | v48.7,39.75 44.64,39.75 v43.37,38.48
DISC  (via drill 0.38)
  Top 0.203: R12.1 10.32,17.97 10.19,17.96 10.24,17.96 11.18,17.02 12.83,17.02 v13.21,16.64 | v28.77,17.72 28.77,20.13 27.26,21.64 UC1.P$53
  Bottom 0.203: v13.21,16.64 14.38,15.47 22.84,15.47 25.07,17.7 27.61,17.7 | v28.77,17.72 28.75,17.7 27.61,17.7 | 27.61,17.7 27.6,17.7
GND  (via drill 0.38, 0.76)  (32 unrouted)
  Top 0.254: v26.92,27.05 26.92,27.56 26.54,27.94 | v26.8,13.34 26.8,13.46 26.16,14.1 | v37.85,12.7 37.21,12.7 | 33.78,13.72 33.78,12.83 v33.91,12.7 | v7.87,3.94 7.87,2.79 | v12.32,3.94 12.32,2.92 | 38.1,16.64 38.61,16.64 v39.12,17.14 | 28.78,26.04 28.78,26.77 v29.03,27.03 | 16,42.16 v16,43.18 | 11.81,35.81 11.56,35.81 11.18,36.2 v11.18,36.83 11.43,37.08 12.06,37.08
  Top 0.406: v26.8,12.06 26.8,11.05 | v32.26,6.35 32.26,7.24 | 10.29,28.19 10.29,29.46 | 10.29,28.19 10.29,28.07 | 10.29,28.19 9.91,28.19 v9.4,27.69 | 9.42,24.38 10.29,24.38 | v9.4,24.38 9.42,24.38 | 8.33,24.31 9.35,24.31 9.42,24.38 | v9.4,21.84 10.29,21.84 | v4.7,48.13 4.7,47.12
  Top 0.61: v13.72,6.1 12.83,6.86 | 17.14,6.86 v18.03,6.1 | v14.1,17.02 14.99,17.02 14.99,18.16 | v23.62,6.1 23.62,7.87 | v17.91,11.43 17.91,12.45 | 24.13,12.45 v25.91,12.45 | v8,35.94 v8.89,35.94 8.89,36.96 8,36.96 v8,35.94
  other vias: 3.56,44.58 41.27,23.75 36.83,21.64 36.83,23.14 24.89,16.56 42.04,36.35
  pour gndplane: 0.64,52.7 48.9,52.7 48.9,40.01 51.44,37.47 51.44,10.16 45.72,10.16 45.72,15.24 29.84,15.24 29.84,10.16 33.02,6.99 33.02,6.35 24.77,6.35 24.77,5.71 34.29,5.71 34.29,7.62 31.11,10.79 31.11,13.97 44.45,13.97 44.45,7.62 48.26,3.81 48.26,1.27 33.66,1.27 33.66,4.45 27.94,4.45 27.94,0.64 0.64,0.64
JTAG-TCK
  Top 0.203: JTAG.3 19.05,20.32 19.05,21.82 19.91,22.68 22.63,22.68 23.58,23.63 23.58,23.64 UC1.P$49
JTAG-TDI
  Top 0.203: UC1.P$50 24.54,23.14 23.62,22.23 20.95,22.23 JTAG.5
JTAG-TDO
  Top 0.203: UC1.P$55 22.92,20.64 21.59,19.3 21.59,18.54 20.83,17.78 19.05,17.78 JTAG.4
JTAG-TMS  (via drill 0.38)
  Top 0.203: UC1.P$46 29.28,24.95 29.28,24.57 v29.46,24.38 29.34,24.38 | JTAG.6 18.54,22.35 19.05,22.35 19.76,23.06 21.34,23.06 22.66,24.38 v23.88,24.38
  Bottom 0.203: v23.88,24.38 24.51,25.02 25.4,25.02 26.04,24.38 v29.46,24.38
JTAG-TRST  (via drill 0.38)
  Top 0.203: 23.19,20.14 UC1.P$56 | 23.19,20.14 22.1,19.05 22.1,18.29 21.84,18.03 21.84,16.51 | 23.19,20.14 23.11,20.07 v23.11,19.94 | UC1.P$7 31.28,20.03 v30.48,20.94 | 16.51,1.78 J4.1 16.38,2.41 16.38,1.91 15.75,1.27 13.97,1.27 R4.2 13.72,1.27 12.19,1.27 RESET.P$2 | v21.84,14.83 21.84,16.51 | 21.84,16.51 JTAG.1
  Bottom 0.203: JTAG.8 19.05,22.86 19.05,17.78 JTAG.1 | v21.84,14.83 17.37,14.83 16.51,13.97 J4.1 | v30.48,20.94 30.48,20.95 24.13,20.95 v23.11,19.94
N$1
  Top 0.61: BAR.PWR 9.14,12.7 6.35,15.49 | JP1.2 3.12,15.49 6.35,15.49 | 6.35,15.49 4.14,15.49 D2.A
N$2
  Top 0.203: 30.17,9.67 OSC.1 30.69,9.73 30.78,9.82 UC1.P$6 | 30.17,9.67 30.1,9.6 | C2.2 31.09,9.67 30.17,9.67
N$3  (via drill 0.38)
  Top 0.203: IC1.P$8 1.14,44.58 v1.14,45.09 | v6.86,43.43 7.75,43.43 10.79,40.39 10.79,40.13 11.3,39.62 11.3,38.97 12.06,38.35 12.08,38.35 R23.2
  Top 0.406: 12.06,38.35 R22.1
  Bottom 0.203: v1.14,45.09 1.14,44.45 2.16,43.43 v6.86,43.43
N$4
  Top 0.254: 37.62,21.64 36.83,21.64
N$5  (via drill 0.6)
  Top 0.813: D2.C 7.04,18.21 6.99,18.16 v6.99,19.68
  Route15 0.61: 14.1,29.84 16.51,29.84 PWR.8
  Route15 0.813: v6.99,19.68 6.48,20.19 6.48,28.96 7.87,30.35 12.7,30.35 13.21,29.84 14.1,29.84
N$6
  Top 0.203: 26.92,7.32 26.63,7.36 OSC.3 | 26.42,7.44 26.41,7.43 OSC.3 | OSC.3 26.74,7.43 27.05,7.75 27.43,7.75 28.57,8.89 28.57,10.16 28.7,10.29 | 28.7,10.29 28.96,10.54 29.95,10.54 30.28,10.87 UC1.P$5 | C1.2 28.19,10.79 28.7,10.29
N$7
  Top 0.203: 13.59,41.92 R6.2 D1.A
N$8
  Top 0.203: Q2.2 13.15,24.2 12.09,23.14 R7.2
N$9
  Top 0.203: 11.66,20.6 11.68,20.57 | 11.66,20.6 R9.1 14.07,20.6 14.1,20.57 Q3.3 | 11.66,20.6 11.62,20.64 R8.2 11.62,21.91 13.08,23.37 14.1,23.37 15.05,24.32 Q2.1
N$10
  Top 0.203: Q3.1 13.16,18.2 13.21,18.16 13.11,18.06 R12.2 11.62,19.24 11.56,19.3 11.58,19.33 R10.1
N$11  (via drill 0.38)
  Top 0.203: C9.2 11.58,28.22 11.56,28.19 11.62,28.13 R13.1 | UC1.P$44 30.28,27.63 27.94,29.97 v27.43,29.97 | 11.56,26.92 11.6,26.92 R13.1 | R13.1 11.65,26.92 | v19.3,27.43 18.03,26.16 12.41,26.16 R13.1
  Bottom 0.203: v27.43,29.97 26.8,29.97 24.26,27.43 v19.3,27.43
N$12  (via drill 0.38)
  Top 0.203: 11.58,24.41 11.56,24.38 | R14.1 11.62,24.45 11.58,24.41 | R7.1 10.29,23.11 | R7.1 | 11.58,24.41 C10.2 | R7.1 11.58,24.41 | UC1.P$45 29.78,27.24 27.81,29.21 v26.92,29.21 | 11.56,25.65 11.6,25.65 R14.1 | v20.07,26.67 19.05,25.65 11.68,25.65 11.66,25.68 R14.1
  Bottom 0.203: v26.92,29.21 24.64,26.92 20.32,26.92 v20.07,26.67
N$13  (via drill 0.6)  (1 unrouted)
  Top 0.203: IC1.P$2 5.17,44.07
  Top 0.254: 5.21,43.56 5.21,44.07 | IC1.P$1 5.03,43.56 5.21,43.56 | 5.21,43.56 v6.1,42.67
  Route15 0.813: v6.1,42.67 7.11,41.53 14.99,41.53 17.78,38.73 PWR.2
N$14
  Top 0.254: 37.52,23.14 36.83,23.14
N$15
  Top 0.254: 25.91,16.64 25.02,16.64 24.89,16.51
N$16  (via drill 0.38, 0.6)
  Top 0.254: v0.89,43.33 0.89,44.07 | 0.89,44.07 1.57,44.07 | C3.2 0.51,46.65 0.51,44.45 0.89,44.07 | IC1.P$10 1.57,43.58 1.57,44.07 | IC1.P$9 2.33,44.07 1.57,44.07
  Top 0.813: v5.97,40.64 5.97,39.12 7.37,39.12 7.38,39.1 LIPO.2 5.97,39.1 v5.97,40.64
  Route15 0.813: v0.89,43.33 1.14,43.05 3.56,40.64 v5.97,40.64
  Bottom 0.61: 14.1,34.92 16.51,34.92 PWR.4
  Bottom 0.813: v5.97,40.64 11.68,34.92 14.1,34.92
N$17
  Top 0.254: 42.04,37.21 42.04,36.32
N$19
  Top 0.203: IC1.P$6 | C3.1 R18.2
  Top 0.254: C3.1 2.07,47.04 IC1.P$6
N$20
  Top 0.203: R20.2 13.59,40.89 | D4.C 15.24,39.75 14.1,40.89 R20.2 | R20.2 13.21,40.89
N$21
  Top 0.203: D3.C 16.76,38.48 | R19.2 14.35,39.62 15.49,38.48 D3.C | D3.C
N$22
  Top 0.203: IC1.P$3 7.49,44.58 11.3,40.77 11.3,40.39 11.94,39.75 11.94,39.74 R19.1 12.06,39.64 12.06,39.88
N$23
  Top 0.203: R20.1 12.06,40.77 | R20.1 12.06,40.89 | IC1.P$4 7.88,45.08 11.94,41.02 11.94,41.01 R20.1 | 12.06,41.02 12.06,40.91 R20.1
N$24
  Top 0.254: 5.21,46.1 5.21,45.59
  Top 0.406: 5.21,46.1 5.21,46.48 4.7,46.99
RX-IP
  Top 0.203: J1-B.2 J1-A.2 J1-B.2 | R1.1 44.45,36.97 J1-B.2
TX-OP
  Top 0.203: J1-B.1 J1-A.1 J1-B.1 | R3.1 45.72,46.99 J1-B.1
USB_P  (via drill 0.38)
  Top 0.203: R16.1 11.66,30.76 11.68,30.73 11.62,30.67 R15.2 11.65,29.46 v12.51,28.57 | UC1.P$52 25.23,22.14 v24.89,22.48 | v21.97,25.27 22.1,25.15 24.13,25.15 v24.89,24.38
  Bottom 0.203: v24.89,24.38 v24.89,22.48 | v12.51,28.57 12.51,25.72 12.95,25.27 v21.97,25.27
USBDM
  Top 0.203: 10.38,26.71 10.32,26.76 R13.2 | X1.D- 10.38,26.71 | 10.38,26.71 10.41,26.67
USBDP
  Top 0.203: 10.39,25.68 10.41,25.65 | 10.39,25.68 R14.2 | X1.D+ 10.16,25.91 10.39,25.68
VCC  (via drill 0.38, 0.6)  (1 unrouted)
  Top 0.203: 39.23,23.64 39.24,23.62 | 39.23,23.64 C6.2 | UC1.P$32 38.05,23.64 39.23,23.64 | R4.1 14.11,2.68 v14.86,3.3
  Top 0.254: UC1.P$48 28.28,26.33 v28.19,27.05 27.94,28.07 27.66,27.96 C7.2 | 38.05,23.64 38.05,23.65 37.29,23.65 v37.29,24.38 | BUT.P$2 42.66,41.31 v42.14,40.79 | BUT.P$4 47.79,41.31 v48.64,42.16 | 18.4,40.86 18.4,40.88 18.39,40.74 v18.39,40.77 18.39,40.84 18.4,40.86 | D4.A D3.A 18.4,40.86 | v24.82,15.47 25.48,16.14 UC1.P$64 26.07,16.14 26.01,16.08 26.04,16.05 26.04,15.39 | 26.04,15.39 C8.2 | UC1.P$1 28.28,14.58 v27.48,14.58 26.67,15.39 26.04,15.39 | v36.7,15.11 36.7,16.64 37.21,17.14 37.59,17.14
  Top 0.406: Q2.3 13.8,21.97 v12.83,21.97 | R10.2 10.3,19.3 v9.37,19.3
  Top 0.813: IC2.2 14.75,6.87 v15.62,7.75 | v19.68,11.05 20.32,11.68 20.32,12.32 20.8,12.32 C4.+
  Route15 0.813: v15.62,7.75 18.92,11.05 v19.68,11.05 | J4.2 J4.3
  Bottom 0.406: v9.37,19.3 10.16,19.3
  pour Route15: 20.07,10.92 21.84,10.92 28.19,10.92 28.19,15.24 45.72,15.24 45.72,10.41 45.72,10.16 51.44,10.16 51.44,37.47 48.9,40.01 48.9,52.7 0.64,52.7 0.64,0.64 22.86,0.64 22.86,2.54 18.41,6.99 18.41,9.53 19.68,10.79 19.81,10.92
VDD  (via drill 0.38, 0.6)
  Top 0.203: UC1.P$13 34.29,13.97 34.29,13.21 v34.8,12.7 C5.2
  Top 0.813: IC3.2 19.98,7.87 C13.+ 20.95,7.9 v20.95,9.14
  pour Route15: 21.59,10.16 20.32,10.16 20.32,8.26 24.13,4.45 33.66,4.45 33.66,1.27 48.26,1.27 48.26,3.81 44.45,7.62 44.45,13.97 31.11,13.97 31.11,10.79 34.29,7.62 34.29,5.71 26.04,5.71
VIN  (via drill 0.38, 0.6)
  Top 0.254: 13.46,36.07 13.34,35.94 13.34,35.83 | 13.34,35.83 13.34,36.07 15.11,36.07 PWR.1 | 13.34,35.83 C11.2
  Top 0.61: C11.2 13.34,35.81 | v14.35,38.35 R22.2
  Top 0.813: C12.+ 14.73,12.45 14.61,12.57 13.72,11.68 IC2.3 | IC3.3 18.03,9.78 15.37,12.45 C12.+ | C12.+ 14.61,12.45
  Top 1.016: C12.+ 14.7,12.57 14.61,12.57 14.48,12.57 14.48,14.35 v14.22,14.61
  Route15 0.813: v19.56,13.84 14.99,13.84 v14.22,14.61 | v14.35,38.35 15.24,37.47 PWR.1 PWR.3
  Route15 1.016: v14.22,14.61 15.24,15.62 PWR.7
  Bottom 0.813: J4.6 29.21,4.19 v19.56,13.84 | PWR.3 PWR.5 PWR.7

### Text on the board
tPlace: grow | 14 | GND | 13 | 12 | 11 | 10 | 9 | 8 | 7 | 6 | 5 | 4 | 3 | 2 | 1 | 0 | PWM | PWM | PWM | PWM | PWM | PWM | PWM | PWM | PWM | PWM | PWM | PWM | AIN | AIN | AIN | AIN | RX1 | TX1 | AIN | AIN | AIN | TX2 | RX2 | + | D1 | DONE | CHRG | CHRG | - | LeafLabs | 3.7V LiPo | BAT | 38 | 37 | Maple | USB | 36 | EXT | 34 | PWRSEL | STM32 | 32 | 30 | JTAG | 28 | EXT | 26 | leaflabs.com | + | 24 | 22 | - | n | - | - | - | 21 | 7-18V | AIN | AIN | AIN | AIN | AIN | AIN | RST | VCC | GND | Vin | 15 | 16 | 17 | 18 | 19 | 20
bPlace: GND | 14 | 13 | 12 | 11 | 10 | 9 | 8 | 7 | 6 | 5 | 4 | 3 | 3 | 2 | 1 | 0 | ck | miso | mosi | ss | SPI1 | I2C1-SDA | I2C1-SCL | GND | 37 | GND | 37 | 35 | 36 | 35 | 33 | 34 SPI2-MOSI | 33 SPI2-MISO | 31 | 32 SPI2-SCK | 31 SPI2-NSS | 41 | 29 | 39 | 30 RX3/I2C2-SDA | 29 TX3/I2C2-SCL | 40 | 27 | 28 PWM/AIN | 27 PWM/AIN | 42 | 43 | 25 | 26 | 25 | 23 | 24 PWM | 23 | 21 | 22 | 21 | 22 | 15 | 16 | 17 | 18 | 19 | 20 | RST | VCC | GND | Vin
tValues: DNP | DNP | JST-Right Angle | DNP | DNP | DNP | DNP